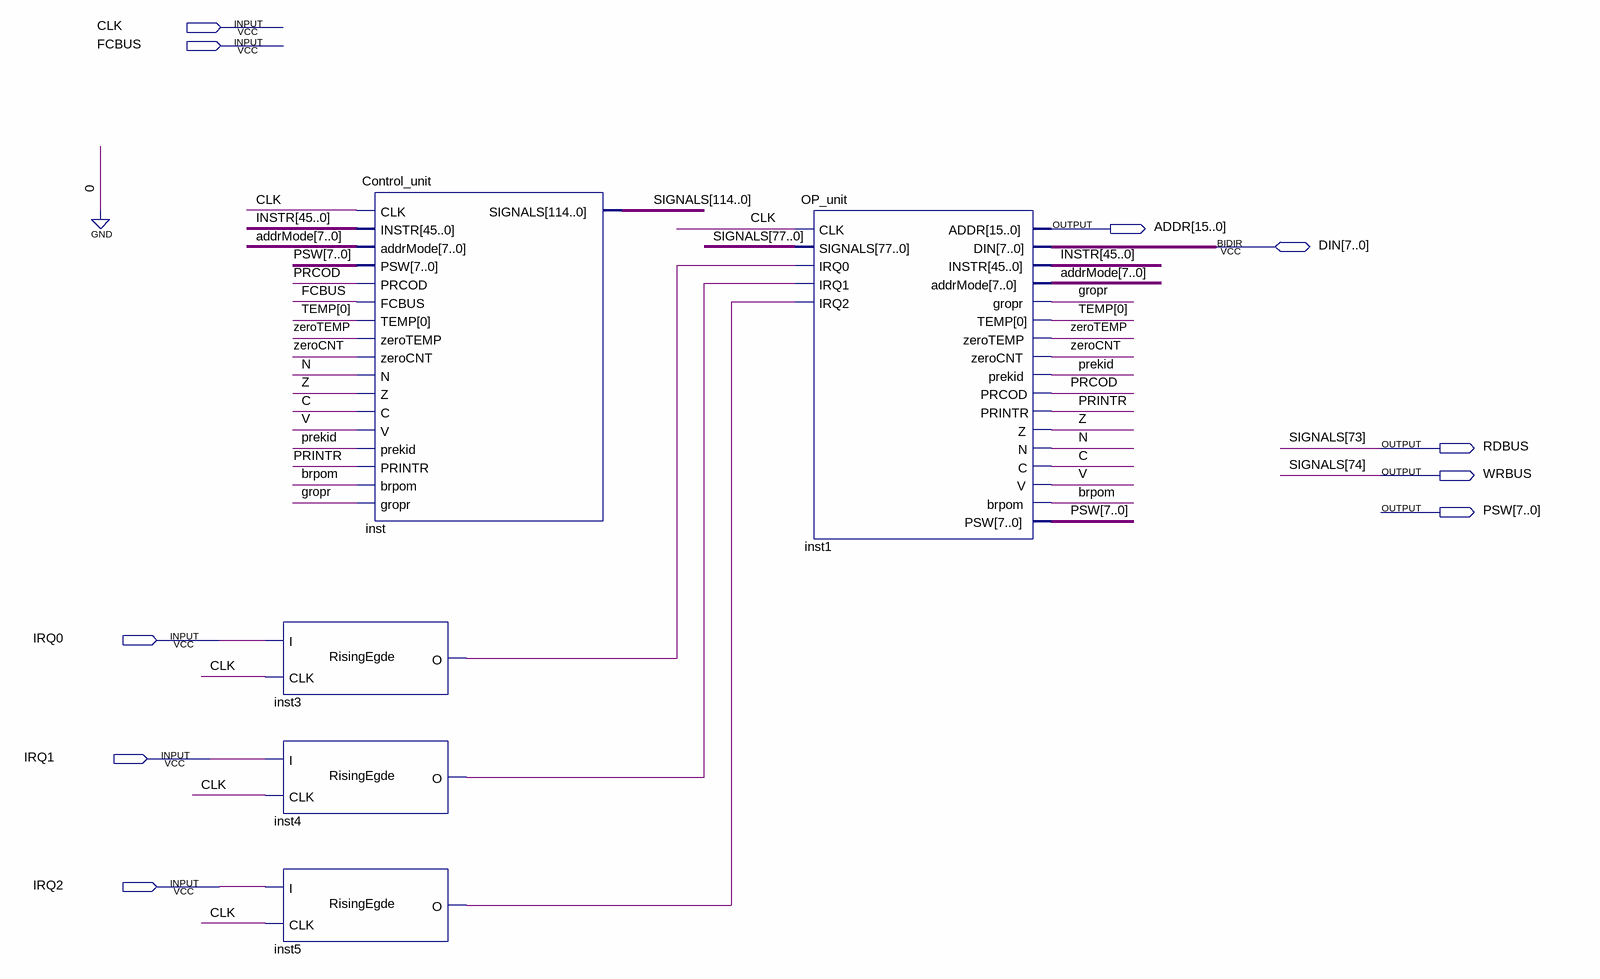
[diagram p0: schematic sheet]
// Quartus schematic CPU.bdf as structural Verilog: 5 symbols, 10 pins
module CPU (
  input  CLK,
  input  FCBUS,
  input  IRQ0,
  input  IRQ1,
  input  IRQ2,
  inout  [7:0] DIN,
  output [15:0] ADDR,
  output RDBUS,
  output WRBUS,
  output [7:0] PSW
);

  wire brpom, C, gropr, inst3_o, inst4_o, inst5_o, N, PRCOD, prekid, PRINTR, V, Z, zeroCNT, zeroTEMP;
  wire [0:0] TEMP;
  wire [7:0] addrMode;
  wire [45:0] INSTR;
  wire [114:0] SIGNALS;

  RisingEgde inst3 (.I(IRQ0), .CLK(CLK), .O(inst3_o));
  RisingEgde inst4 (.I(IRQ1), .CLK(CLK), .O(inst4_o));
  RisingEgde inst5 (.I(IRQ2), .CLK(CLK), .O(inst5_o));
  Control_unit inst (
    .CLK(CLK), .INSTR(INSTR), .addrMode(addrMode), .PSW(PSW), .PRCOD(PRCOD), .FCBUS(FCBUS), .TEMP(TEMP[0]),
    .zeroTEMP(zeroTEMP), .zeroCNT(zeroCNT), .N(N), .Z(Z), .C(C), .V(V), .prekid(prekid), .PRINTR(PRINTR),
    .brpom(brpom), .gropr(gropr), .SIGNALS({SIGNALS[114:75], WRBUS, RDBUS, SIGNALS[72:0]}));
  OP_unit inst1 (
    .CLK(CLK), .SIGNALS({SIGNALS[77:75], WRBUS, RDBUS, SIGNALS[72:0]}), .IRQ0(inst3_o), .IRQ1(inst4_o),
    .IRQ2(inst5_o), .ADDR(ADDR), .INSTR(INSTR), .addrMode(addrMode), .gropr(gropr), .TEMP(TEMP[0]),
    .zeroTEMP(zeroTEMP), .zeroCNT(zeroCNT), .prekid(prekid), .PRCOD(PRCOD), .PRINTR(PRINTR), .Z(Z), .N(N),
    .C(C), .V(V), .brpom(brpom), .PSW(PSW), .DIN(DIN));

  // Other names for the same wires on the sheet: SIGNALS[74:73] = {WRBUS, RDBUS}
endmodule
